# Altium project Audio-Module.PrjPcb
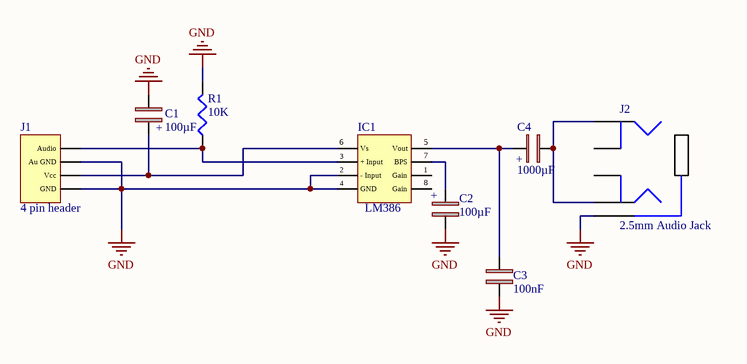
[diagram p0: Audio-Module-SCH.SchDoc]
1 sheet, 8 parts. Net scope: global (net labels, ports and power ports of the same name join across sheets).
Board file: Audio-Module.PcbDoc

## Sheet Audio-Module-SCH.SchDoc
size A4; SheetNumber: 1; SheetTotal: 1

### Parts
C1  100µF  [ELCO]
C2  100µF  [ELCO]
C3  100nF  [CAPACITOR 1206]
C4  1000µF  [ELCO]
IC1  LM386  [LM386 SOP8]
J1  4 pin header  [4 HDR]
J2  2.5mm Audio Jack  [AUDIO JACK]
R1  10K  [RESISTOR 0805]

### Nets
GND: C1.2(-) C2.2(-) C3.2 IC1.2(-_Input) IC1.4(GND) J1.1(GND) J1.3(Au_GND) J2.5(Sleeve) R1.2
NetC1_1: C1.1(+) IC1.6(Vs) J1.2(Vcc)
NetC2_1: C2.1(+) IC1.7(BPS)
NetC3_1: C3.1 C4.1(+) IC1.5(Vout)
NetC4_2: C4.2(-) J2.1(Ring) J2.4(Tip)
NetIC1_3: IC1.3(+_Input) J1.4(Audio) R1.1

Not connected (* = marked no-connect by the designer): IC1 1(Gain) 8(Gain); J2 2(Ring_Switch) 3(Tip_Switch)

### Library data of the parts
C1 C2 = Capacitor: 100µF (elco): CAP ALUM 100UF 20% 10V SMD; Manufacturer: Panasonic; Manufacturer Part Number: EEE-1AA101WR; Ripple Current: 50mA; Life (Hours): 1000Hour; Supplier 1: Rs; RoHS: Yes; Category: Aluminum Electrolytic Capacitors; Stock 1: 2900; Pricing 1: 50=0,23400, 250=0,13800, 500=0,11000 (EUR); Mount: Surface Mount,PCB; Case/Package: Radial; Contact Plating: Tin; Min Operating Temperature: -40°C; Max Operating Temperature: 85°C; Capacitance: 100uF; Voltage Rating: 10V; Tolerance: 20%; Packaging: Tape and Reel; Package Quantity: 1000; Voltage Rating (DC): 10V; Termination: SMD/SMT; Series: S; Construction: Cylindrical; Ripple Current (AC): 50mA; Diameter: 5mm; Length: 5.5mm; Height: 5.4mm; Height - Seated (Max): 0.213inch; Ratings: AEC-Q200; Radiation Hardening: No; RoHS Compliant: Yes; Lead Free: Lead Free; ComponentLink1URL: https://datasheet.ciiva.com/26945/getdatasheetpartid-169213-26945071.pdf?src-supplier=Verical; ComponentLink1Description: https://datasheet.ciiva.com/26945/getdatasheetpartid-169213-26945071.pdf?src-supplier=Verical; ComponentLink2URL: https://datasheet.ciiva.com/24027/aba0000ce2-40801-24027541.pdf?src-supplier=Mouser; ComponentLink2Description: https://datasheet.ciiva.com/24027/aba0000ce2-40801-24027541.pdf?src-supplier=Mouser; ComponentLink3URL: https://datasheet.ciiva.com/14598/70255710-14598233.pdf?src-supplier=Allied+Electronics; ComponentLink3Description: https://datasheet.ciiva.com/14598/70255710-14598233.pdf?src-supplier=Allied+Electronics; ComponentLink4URL: https://datasheet.ciiva.com/14605/70255710-14605689.pdf?src-supplier=Allied+Electronics; ComponentLink4Description: https://datasheet.ciiva.com/14605/70255710-14605689.pdf?src-supplier=Allied+Electronics; ComponentLink5URL: https://datasheet.ciiva.com/11673/aba0000ce2-11673882.pdf?src-supplier=Avnet; ComponentLink5Description: https://datasheet.ciiva.com/11673/aba0000ce2-11673882.pdf?src-supplier=Avnet; ComponentLink6URL: https://datasheet.ciiva.com/16427/aba0000ce2-16427544.pdf?src-supplier=Future+Electronics; ComponentLink6Description: https://datasheet.ciiva.com/16427/aba0000ce2-16427544.pdf?src-supplier=Future+Electronics; ComponentLink7URL: https://datasheet.ciiva.com/2983/aba0000ce2-2983906.pdf?src-supplier=Avnet; ComponentLink7Description: https://datasheet.ciiva.com/2983/aba0000ce2-2983906.pdf?src-supplier=Avnet; ComponentLink8URL: https://datasheet.ciiva.com/30075/11aba0000ce2-30075303.pdf?src-supplier=Onlinecomponents.com; ComponentLink8Description: https://datasheet.ciiva.com/30075/11aba0000ce2-30075303.pdf?src-supplier=Onlinecomponents.com; Supplier Part Number 1: 1766372
C3 = Capacitor: 100nF: Ceramic capacitor SMD-1206 100nF /50V X7R# K +-10%, AVX, RoHS, /4000 reel/; Manufacturer: Kyocera AVX; Manufacturer Part Number: 12065C104KAT2A; Tolerance: 10%; Voltage Rating: 50V; Dielectric: X7R; Insulation Resistance: 100GR; Dissipation Factor: 2.5%; Supplier 1: Farnell; RoHS: Yes; Category: Ceramic Capacitors; Stock 1: 188000; Pricing 1: 4000=0,02600, 20000=0,02520, 40000=0,02440 (EUR); Mount: Surface Mount,PCB; Case/Package: 1206; Number of Pins: 2; Case Code (Metric): 3216; Case Code (Imperial): 1206; Dielectric Material: Ceramic; Contact Plating: Tin,Matte; Min Operating Temperature: -55°C; Max Operating Temperature: 125°C; Packaging: Tape and Reel; Capacitance: 100nF; Voltage Rating (DC): 50V; Voltage: 50V; Series: -; Package Quantity: 1; Termination: SMD/SMT; Construction: Flat; Length: 3.2mm; Width: 1.6mm; Height: 0.94mm; Depth: 1.6mm; Thickness: 0.037inch; Radiation Hardening: No; Lead Free: Lead Free; RoHS Compliant: Yes; Reach SVHC Compliant: Yes; ComponentLink1URL: https://datasheet.ciiva.com/11786/0900766b80ed4be2-11786988.pdf?src-supplier=Rs; ComponentLink1Description: https://datasheet.ciiva.com/11786/0900766b80ed4be2-11786988.pdf?src-supplier=Rs; ComponentLink2URL: https://datasheet.ciiva.com/2988/cx7r-2988135.pdf?src-supplier=Avnet; ComponentLink2Description: https://datasheet.ciiva.com/2988/cx7r-2988135.pdf?src-supplier=Avnet; ComponentLink3URL: https://datasheet.ciiva.com/16375/cx7r-16375719.pdf?src-supplier=Future+Electronics; ComponentLink3Description: https://datasheet.ciiva.com/16375/cx7r-16375719.pdf?src-supplier=Future+Electronics; ComponentLink4URL: https://datasheet.ciiva.com/2988/cx7r-2988136.pdf?src-supplier=Avnet; ComponentLink4Description: https://datasheet.ciiva.com/2988/cx7r-2988136.pdf?src-supplier=Avnet; ComponentLink5URL: https://datasheet.ciiva.com/7833/cx7r-7833405.pdf?src-supplier=Element14; ComponentLink5Description: https://datasheet.ciiva.com/7833/cx7r-7833405.pdf?src-supplier=Element14; ComponentLink6URL: https://datasheet.ciiva.com/25796/cx7r-25796358.pdf?src-supplier=Farnell; ComponentLink6Description: https://datasheet.ciiva.com/25796/cx7r-25796358.pdf?src-supplier=Farnell; ComponentLink7URL: https://datasheet.ciiva.com/7833/cx7r-7833402.pdf?src-supplier=Element14; ComponentLink7Description: https://datasheet.ciiva.com/7833/cx7r-7833402.pdf?src-supplier=Element14; ComponentLink8URL: https://datasheet.ciiva.com/150/cx7r-150390.pdf?src-supplier=Digi-Key; ComponentLink8Description: https://datasheet.ciiva.com/150/cx7r-150390.pdf?src-supplier=Digi-Key; ComponentLink9URL: https://datasheet.ciiva.com/150/cx7r-150389.pdf?src-supplier=Digi-Key; ComponentLink9Description: https://datasheet.ciiva.com/150/cx7r-150389.pdf?src-supplier=Digi-Key; ComponentLink10URL: https://datasheet.ciiva.com/150/cx7r-150391.pdf?src-supplier=Digi-Key; ComponentLink10Description: https://datasheet.ciiva.com/150/cx7r-150391.pdf?src-supplier=Digi-Key; ComponentLink11URL: https://datasheet.ciiva.com/7833/cx7r-7833403.pdf?src-supplier=Element14; ComponentLink11Description: https://datasheet.ciiva.com/7833/cx7r-7833403.pdf?src-supplier=Element14; ComponentLink12URL: https://datasheet.ciiva.com/7833/cx7r-7833404.pdf?src-supplier=Element14; ComponentLink12Description: https://datasheet.ciiva.com/7833/cx7r-7833404.pdf?src-supplier=Element14; ComponentLink13URL: https://datasheet.ciiva.com/5415/cx7r-218113-5415909.pdf?src-supplier=Mouser; ComponentLink13Description: https://datasheet.ciiva.com/5415/cx7r-218113-5415909.pdf?src-supplier=Mouser; ComponentLink14URL: https://datasheet.ciiva.com/14584/70001075-14584956.pdf?src-supplier=Allied+Electronics; ComponentLink14Description: https://datasheet.ciiva.com/14584/70001075-14584956.pdf?src-supplier=Allied+Electronics; Supplier Part Number 1: 2281081
C4 = Capacitor: 1000µF (elco): Capacitor; Aluminum Electrolytic; Ecap 1000uF 25V H13 Case FK SMT; Manufacturer: Panasonic; Manufacturer Part Number: EEE-FK1E102AQ; Tolerance: 20%; Capacitance: 1mF; Ripple Current: 1.1A; Life (Hours): 5000Hour; ESR (Equivalent Series Resistance): 60mR; Polarity: Polar; Supplier 1: Rs; RoHS: Yes; Category: Aluminum Electrolytic Capacitors; Stock 1: 5; Pricing 1: 50=1,92800, 100=1,80600, 250=1,68200, 500=1,52800 (EUR); Mount: Surface Mount,PCB; Case/Package: Radial; Min Operating Temperature: -55°C; Max Operating Temperature: 105°C; Packaging: Tape and Reel; Package Quantity: 200; Voltage Rating: 25V; Voltage Rating (DC): 25V; Termination: SMD/SMT; Series: FK; Voltage: 25V; Construction: Cylindrical; Impedance: 60mR; Ripple Current (AC): 1.1A; Diameter: 12.5mm; Length: 13.5mm; Height: 13.5mm; Height - Seated (Max): 0.55inch; Ratings: AEC-Q200; Radiation Hardening: No; Reach SVHC Compliant: Yes; RoHS Compliant: Yes; Lead Free: Lead Free; Supplier Part Number 1: 7083869P
IC1 = IC: LM386: Audio Amplifier, 0.325W, 1 Chann; Manufacturer: TI National Semiconductor; Manufacturer Part Number: LM386M-1; Number of Channels: 1; Output Power: 250mW; Max Supply Voltage: 12V; Min Supply Voltage: 4V; Max Power Dissipation: 730mW; Nominal Supply Current: 4mA; Voltage Gain: 46dB; Max Output Power: 325mW; Power Supply Rejection Ratio (PSRR): 50dB; Input Bias Current: 250nA; Supply Type: Single; Bandwidth: 300kHz; Load Impedance: 8R; Quiescent Current: 8mA; Input Offset Voltage (Vos): 2.5mV; Amplifier Type: POWER; Supplier 1: Farnell; RoHS: No; Category: Amplifiers - Audio; Pricing 1: 1=0,75500, 50=0,66000, 100=0,50700, 250=0,47800, 500=0,44800, 1000=0,35400, 2500=0,34700, 5000=0,34000 (EUR); Case/Package: D; Number of Pins: 8; Weight: 0.006lb; Min Operating Temperature: 0°C; Max Operating Temperature: 70°C; Packaging: Rail/Tube; Package Quantity: 95; Power Dissipation: 730mW; Series: -; Number of Amplifiers: 1; Unity Gain Bandwidth Product: 300kHz; Termination: SMD/SMT; Length: 4.9mm; Width: 3.9mm; Height: 1.45mm; Reach SVHC Compliant: Yes; Lead Free: Contains Lead; RoHS Compliant: No; ComponentLink1URL: https://datasheet.ciiva.com/14667/0900766b800333d0-14667266.pdf?src-supplier=Rs; ComponentLink1Description: https://datasheet.ciiva.com/14667/0900766b800333d0-14667266.pdf?src-supplier=Rs; ComponentLink2URL: https://datasheet.ciiva.com/1480/1640767-1480992.pdf?src-supplier=Element14; ComponentLink2Description: https://datasheet.ciiva.com/1480/1640767-1480992.pdf?src-supplier=Element14; ComponentLink3URL: https://datasheet.ciiva.com/1482/1640767-1482305.pdf?src-supplier=Element14; ComponentLink3Description: https://datasheet.ciiva.com/1482/1640767-1482305.pdf?src-supplier=Element14; ComponentLink4URL: https://datasheet.ciiva.com/2967/lm386-2967890.pdf?src-supplier=Avnet; ComponentLink4Description: https://datasheet.ciiva.com/2967/lm386-2967890.pdf?src-supplier=Avnet; Supplier Part Number 1: 9488324
J1 = CONNECTOR: 4 pin header: Male 4 pin header
J2 = Connector: Audio Jack: Conn Audio RCP 6 POS Solder RA SMD 6 Terminal 1 Port T/R; Manufacturer: Kycon; Manufacturer Part Number: STX-25427-6N-TR; Gender: Female; Voltage Rating: 250V; Number of Contacts: 6; Supplier 1: Mouser; RoHS: Yes; Category: Connectors; Stock 1: 623; Pricing 1: 1=1,84000, 10=1,50000, 50=1,50000, 100=1,43000, 1000=1,19000, 10000=0,90300 (USD); Mount: Surface Mount; Color: Black; Contact Material: Copper Alloy; Contact Plating: Gold; Package Quantity: 1250; Packaging: Tape and Reel; Termination: SMD/SMT; Orientation: Horizontal; Series: STX-25427; Radiation Hardening: No; RoHS Compliant: Yes; ComponentLink1URL: https://datasheet.ciiva.com/5054/stx25427-181552-5054121.pdf?src-supplier=Mouser; ComponentLink1Description: https://datasheet.ciiva.com/5054/stx25427-181552-5054121.pdf?src-supplier=Mouser; Supplier Part Number 1: 806-STX-25427-6N-TR
R1 = Resistor: 10K R: Res Thick Film 0805 10K Ohm 5% 1/8W ±200ppm/°C Molded SMD SMD Paper T/R; Manufacturer: Vishay Dale; Manufacturer Part Number: CRCW080510K0JNEB; Resistance: 10kR; Power Rating: 125mW; Voltage Rating: 150V; Supplier 1: Avnet; RoHS: Yes; Category: Chip SMD Resistors; Stock 1: 90000; Pricing 1: 10000=0,02220, 20000=0,02100, 40000=0,01980, 60000=0,01860, 80000=0,01740, 100000=0,01620, 1000000=0,01500 (USD); Case/Package: 0805; Case Code (Imperial): 0805; Case Code (Metric): 2012; Contact Plating: Tin; Weight: 0.000194oz; Min Operating Temperature: -55°C; Max Operating Temperature: 155°C; Packaging: Tape and Reel; Tolerance: 5%; Resistor Type: Thick Film; Temperature Coefficient: 200ppm/°C; Series: CRCW; Max Power Dissipation: 125mW; Number of Terminations: 2; Termination: SMD/SMT; Package Quantity: 10000; Voltage Rating (DC): 150V; Features: Automotive AEC-Q200; Resistance Tolerance: 5%; Construction: Rectangular; Technology: THICK FILM; Working Voltage: 150V; Length: 0.079inch; Width: 1.25mm; Height: 0.02inch; Depth: 1.25mm; Radiation Hardening: No; RoHS Compliant: Yes; Lead Free: Lead Free; Military Standard: Not; ComponentLink1URL: https://datasheet.ciiva.com/16199/dcrcwe3-16199191.pdf?src-supplier=Future+Electronics; ComponentLink1Description: https://datasheet.ciiva.com/16199/dcrcwe3-16199191.pdf?src-supplier=Future+Electronics; ComponentLink2URL: https://datasheet.ciiva.com/7725/dcrcwe3-7725772.pdf?src-supplier=Element14; ComponentLink2Description: https://datasheet.ciiva.com/7725/dcrcwe3-7725772.pdf?src-supplier=Element14; ComponentLink3URL: https://datasheet.ciiva.com/3258/dcrcwe3-3258030.pdf?src-supplier=Avnet; ComponentLink3Description: https://datasheet.ciiva.com/3258/dcrcwe3-3258030.pdf?src-supplier=Avnet; Supplier Part Number 1: CRCW080510K0JNEB